# Altium schematic sheet Sheet1.SchDoc: Projet M1 2024
size A4; DrawnBy: J.CLEMENT & D.FOURNIER; DocumentNumber: 1; Revision: V1.0 Rev A; SheetNumber: 1; SheetTotal: 2
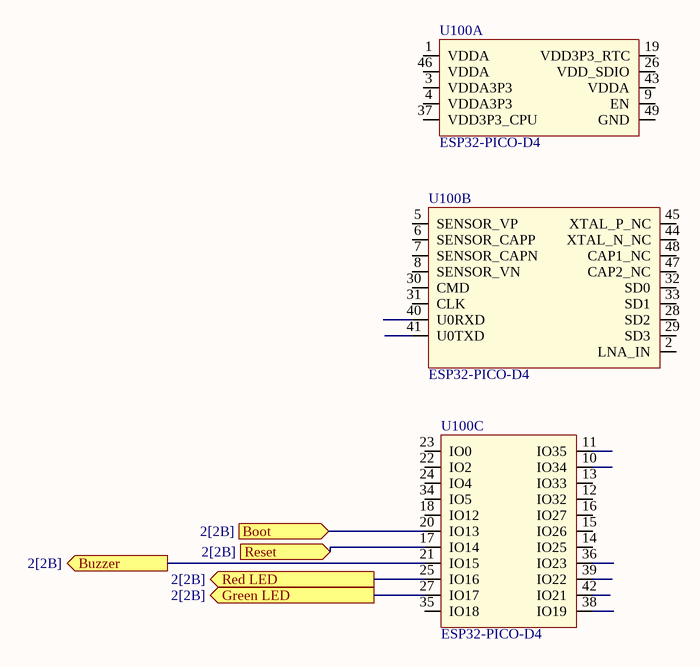
[diagram p0: Sheet1.SchDoc]

## Parts
U100  ESP32-PICO-D4  [PQFN50P700X700X104_HS-49N]  (parts A,B,C of 3)

## Ports
Boot (in, see 2[2B]), Buzzer (out, see 2[2B]), Green LED (out, see 2[2B]), Red LED (out, see 2[2B]), Reset (in, see 2[2B])

## Nets
Boot: U100.20(IO13) ; port Boot
Buzzer: U100.21(IO15) ; port Buzzer
Green LED: U100.27(IO17) ; port Green LED
Red LED: U100.25(IO16) ; port Red LED
Reset: U100.17(IO14) ; port Reset

Not connected (* = marked no-connect by the designer): U100 1(VDDA) 2(LNA_IN) 3(VDDA3P3) 4(VDDA3P3) 5(SENSOR_VP) 6(SENSOR_CAPP) 7(SENSOR_CAPN) 8(SENSOR_VN) 9(EN) 10(IO34) 11(IO35) 12(IO32) 13(IO33) 14(IO25) 15(IO26) 16(IO27) 18(IO12) 19(VDD3P3_RTC) 22(IO2) 23(IO0) 24(IO4) 26(VDD_SDIO) 28(SD2) 29(SD3) 30(CMD) 31(CLK) 32(SD0) 33(SD1) 34(IO5) 35(IO18) 36(IO23) 37(VDD3P3_CPU) 38(IO19) 39(IO22) 40(U0RXD) 41(U0TXD) 42(IO21) 43(VDDA) 44(XTAL_N_NC) 45(XTAL_P_NC) 46(VDDA) 47(CAP2_NC) 48(CAP1_NC) 49(GND)

## Library data of the parts
U100 = ESP32: Système RF sur puce - SoC SIP module ESP32 with 4MByte Flash, Dual Core MCU, Wi-Fi & Bluetooth Combo, LGA48-pin, 7*7mm; Manufacturer 1: Espressif Systems; Supplier 1: Digi-Key; Supplier Part Number 1: 1904-1029-1-ND; Manufacturer Part Number 1: ESP32-PICO-D4